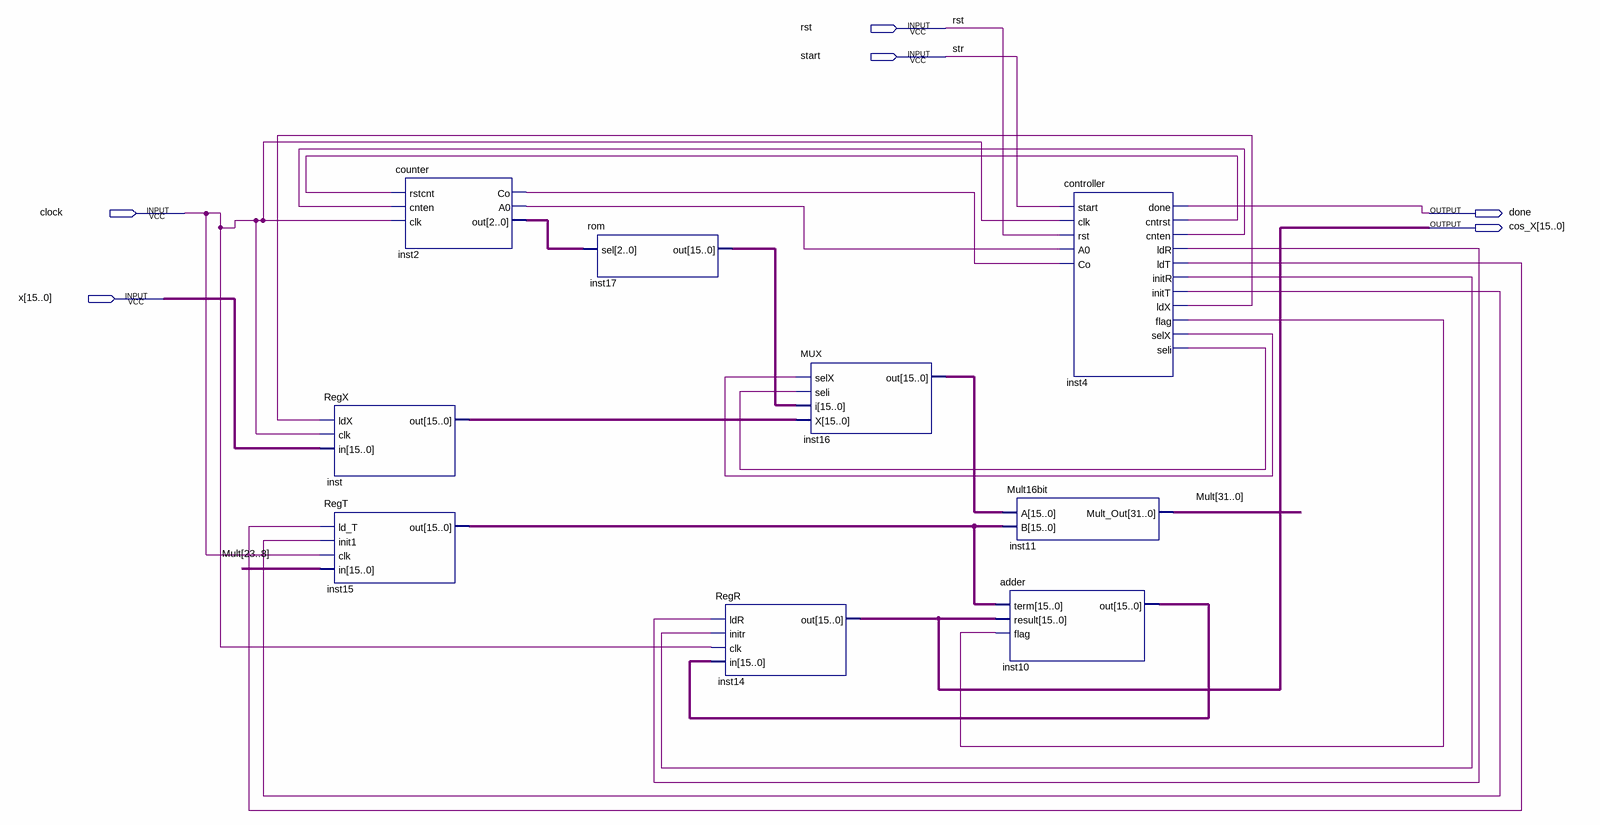
[diagram p0: schematic sheet]
// Quartus schematic hamed.bdf as structural Verilog: 9 symbols, 6 pins
module hamed (
  input  rst,
  input  start,
  input  clock,
  input  [15:0] x,
  output done,
  output [15:0] cos_X
);

  wire inst2_a0, inst2_co, inst4_cnten, inst4_cntrst, inst4_flag, inst4_initr, inst4_initt, inst4_ldr,
       inst4_ldt, inst4_ldx, inst4_seli, inst4_selx;
  wire [2:0] inst2_out;
  wire [15:0] inst10_out, inst15_out, inst16_out, inst17_out, inst_out;
  wire [31:0] Mult;

  RegX inst (.ldX(inst4_ldx), .clk(clock), .in(x), .out(inst_out));
  RegT inst15 (.ld_T(inst4_ldt), .init1(inst4_initt), .clk(clock), .in(Mult[23:8]), .out(inst15_out));
  counter inst2 (
    .rstcnt(inst4_cntrst), .cnten(inst4_cnten), .clk(clock), .Co(inst2_co), .A0(inst2_a0), .out(inst2_out));
  rom inst17 (.sel(inst2_out), .out(inst17_out));
  RegR inst14 (.ldR(inst4_ldr), .initr(inst4_initr), .clk(clock), .in(inst10_out), .out(cos_X));
  MUX inst16 (.selX(inst4_selx), .seli(inst4_seli), .i(inst17_out), .X(inst_out), .out(inst16_out));
  Mult16bit inst11 (.A(inst16_out), .B(inst15_out), .Mult_Out(Mult));
  adder inst10 (.term(inst15_out), .result(cos_X), .flag(inst4_flag), .out(inst10_out));
  controller inst4 (
    .start(start), .clk(clock), .rst(rst), .A0(inst2_a0), .Co(inst2_co), .done(done), .cntrst(inst4_cntrst),
    .cnten(inst4_cnten), .ldR(inst4_ldr), .ldT(inst4_ldt), .initR(inst4_initr), .initT(inst4_initt),
    .ldX(inst4_ldx), .flag(inst4_flag), .selX(inst4_selx), .seli(inst4_seli));

  // Other names for the same wires on the sheet: str = start
endmodule
